# EAGLE schematic Main (EAGLE 8.7.1)
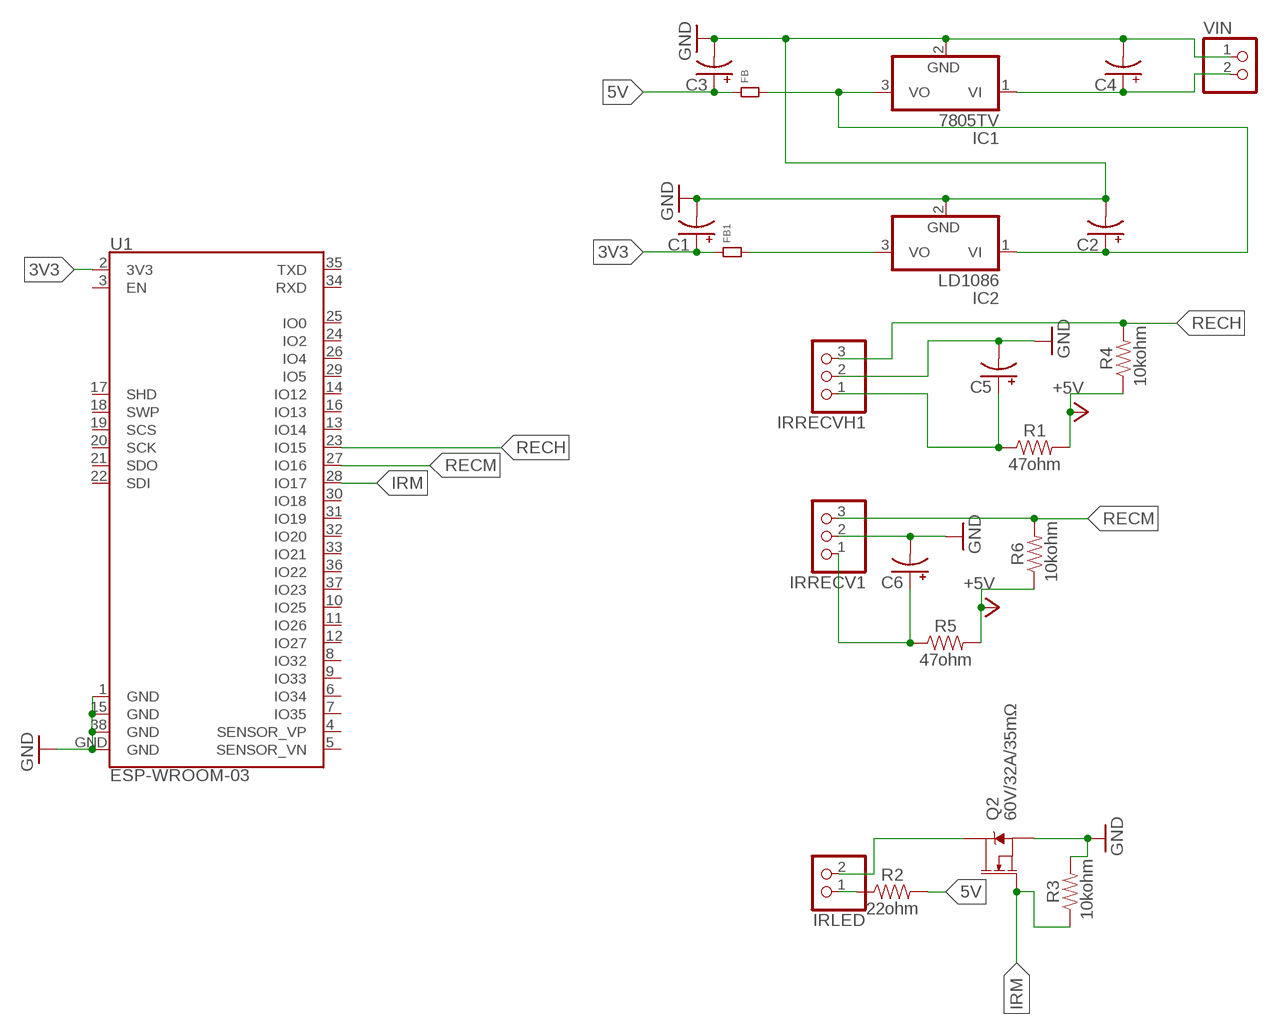
[diagram p0: schematic, sheet 1]

## Parts
C1  CPOL-USE2-5  [E2-5]
C2  CPOL-USE2-5  [E2-5]
C3  CPOL-USE2-5  [E2-5]
C4  CPOL-USE2-5  [E2-5]
C5  CPOL-USE2-5  [E2-5]
C6  CPOL-USE2-5  [E2-5]
FB  RESISTOR.0603  [0603]
FB1  RESISTOR.0603  [0603]
IC1  7805TV  [TO220V]
IC2  LD1086  7805TV  [TO220V]
IRLED  PINHD-1X2  [1X02]
IRRECV1  PINHD-1X3  [1X03]
IRRECVH1  PINHD-1X3  [1X03]
Q2  60V/32A/35mΩ  MOSFET-NCH-FQP30N06L  [TO220V]
R1  47ohm  RESISTORAXIAL-0.3  [AXIAL-0.3]
R2  22ohm  RESISTORAXIAL-0.3  [AXIAL-0.3]
R3  10kohm  RESISTORAXIAL-0.3  [AXIAL-0.3]
R4  10kohm  RESISTORAXIAL-0.3  [AXIAL-0.3]
R5  47ohm  RESISTORAXIAL-0.3  [AXIAL-0.3]
R6  10kohm  RESISTORAXIAL-0.3  [AXIAL-0.3]
U1  ESP-WROOM-03  [ESP-WROOM-03]
VIN  PINHD-1X2  [1X02]

## Nets
3V3: C1.+ FB1.1 U1.2(3V3)
5V: C3.+ FB.1 R2.P$2
+5V: R1.P$2 R4.P$1 R5.P$2 R6.P$1
GND: C1.- C2.- C3.- C4.- C5.- C6.- IC1.2(GND) IC2.2(GND) IRRECV1.2 IRRECVH1.2 Q2.3(S) R3.P$2 U1.1(GND) U1.15(GND) U1.38(GND) U1.GND VIN.1
IRM: Q2.1(G) R3.P$1 U1.28(IO17)
N$1: FB1.2 IC2.3(VO)
N$2: C2.+ FB.2 IC1.3(VO) IC2.1(VI)
N$4: C6.+ IRRECV1.1 R5.P$1
N$5: C4.+ IC1.1(VI) VIN.2
N$7: IRLED.1 R2.P$1
N$8: IRLED.2 Q2.2(D)
N$10: C5.+ IRRECVH1.1 R1.P$1
RECH: IRRECVH1.3 R4.P$2 U1.23(IO15)
RECM: IRRECV1.3 R6.P$2 U1.27(IO16)
Unconnected: U1.3(EN) U1.4(SENSOR_VP) U1.5(SENSOR_VN) U1.6(IO34) U1.7(IO35) U1.8(IO32) U1.9(IO33) U1.10(IO25) U1.11(IO26) U1.12(IO27) U1.13(IO14) U1.14(IO12) U1.16(IO13) U1.17(SHD) U1.18(SWP) U1.19(SCS) U1.20(SCK) U1.21(SDO) U1.22(SDI) U1.24(IO2) U1.25(IO0) U1.26(IO4) U1.29(IO5) U1.30(IO18) U1.31(IO19) U1.32(IO20) U1.33(IO21) U1.34(RXD) U1.35(TXD) U1.36(IO22) U1.37(IO23)

## Library data of the parts
C1-C6 = rcl:CPOL-US: POLARIZED CAPACITOR, American symbol; SPICEPREFIX: C
FB FB1 = standardparts:RESISTOR
IC1 IC2 = linear:78*: Positive VOLTAGE REGULATOR Source: http://cache.national.com/ds/LM/LM78L05.pdf http://www.fairchildsemi.com/ds/LM/LM7805.pdf
IRLED VIN = pinhead:PINHD-1X2: PIN HEADER
IRRECV1 IRRECVH1 = pinhead:PINHD-1X3: PIN HEADER
Q2 = SparkFun-DiscreteSemi:MOSFET-NCH: N-channel MOSFETs Voltage controlled devices that allow control of high current outputs. SparkFun Products: SparkFun OpenScale <https://www.sparkfun.com/products/13261> SparkFun Digital Sandbox <https://www.sparkfun.com/products/12651> SparkFun Monster Moto Shield <https://www.sparkfun.com/products/10182> SparkFun MOSFET Power Controller <https://www.sparkfun.com/products/11214>; PROD_ID: TRANS-10060
R1-R6 = SparkFun-Resistors:RESISTOR: Generic Resistor Package
U1 = esp32:ESP-WROOM-03